# Altium schematic sheet Single LED.SchDoc: Indicator LED
size A4; DocumentNumber: 2; SheetNumber: 2; SheetTotal: 2
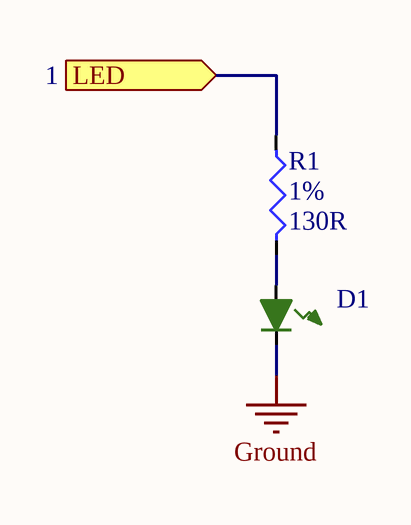
[diagram p0: Single LED.SchDoc]

## Parts
D1  LED Green 0603 Signal 571nm  [0603 LED Green]  (value not drawn)
R1  Tolerance: 1%  Resistance: 130R  [0603 Resistor]  (hidden comment: Resistor 130R 0603 1%)

## Ports
LED (in, see 1)

## Nets
Ground: D1.2
LED: R1.2 ; port LED
NetD1_1: D1.1 R1.1

## Library data of the parts
D1 = LED Green 0603 Signal 571nm: Manufacturer: Lite-On Inc.; Manufacturer Part Number: LTST-C191KGKT; Process Type: SMT; Current Rating: 30mA; ComponentLink1Description: Spec Sheet; Max Operating Temperature: 85ºC; Min Operating Temperature: -55ºC; Package: 0603; Wavelength: 571nm
R1 = Resistor 130R 0603 1%: Manufacturer: Yageo; Manufacturer Part Number: RC0603FR-07130RL; Process Type: SMT; Power Rating: 100mW; Voltage Rating: 75V; ComponentLink1Description: Data Sheet; Max Operating Temperature: 155ºC; Min Operating Temperature: -55ºC; Package: 0603